# EAGLE design FanControl (EAGLE 7.6.0)
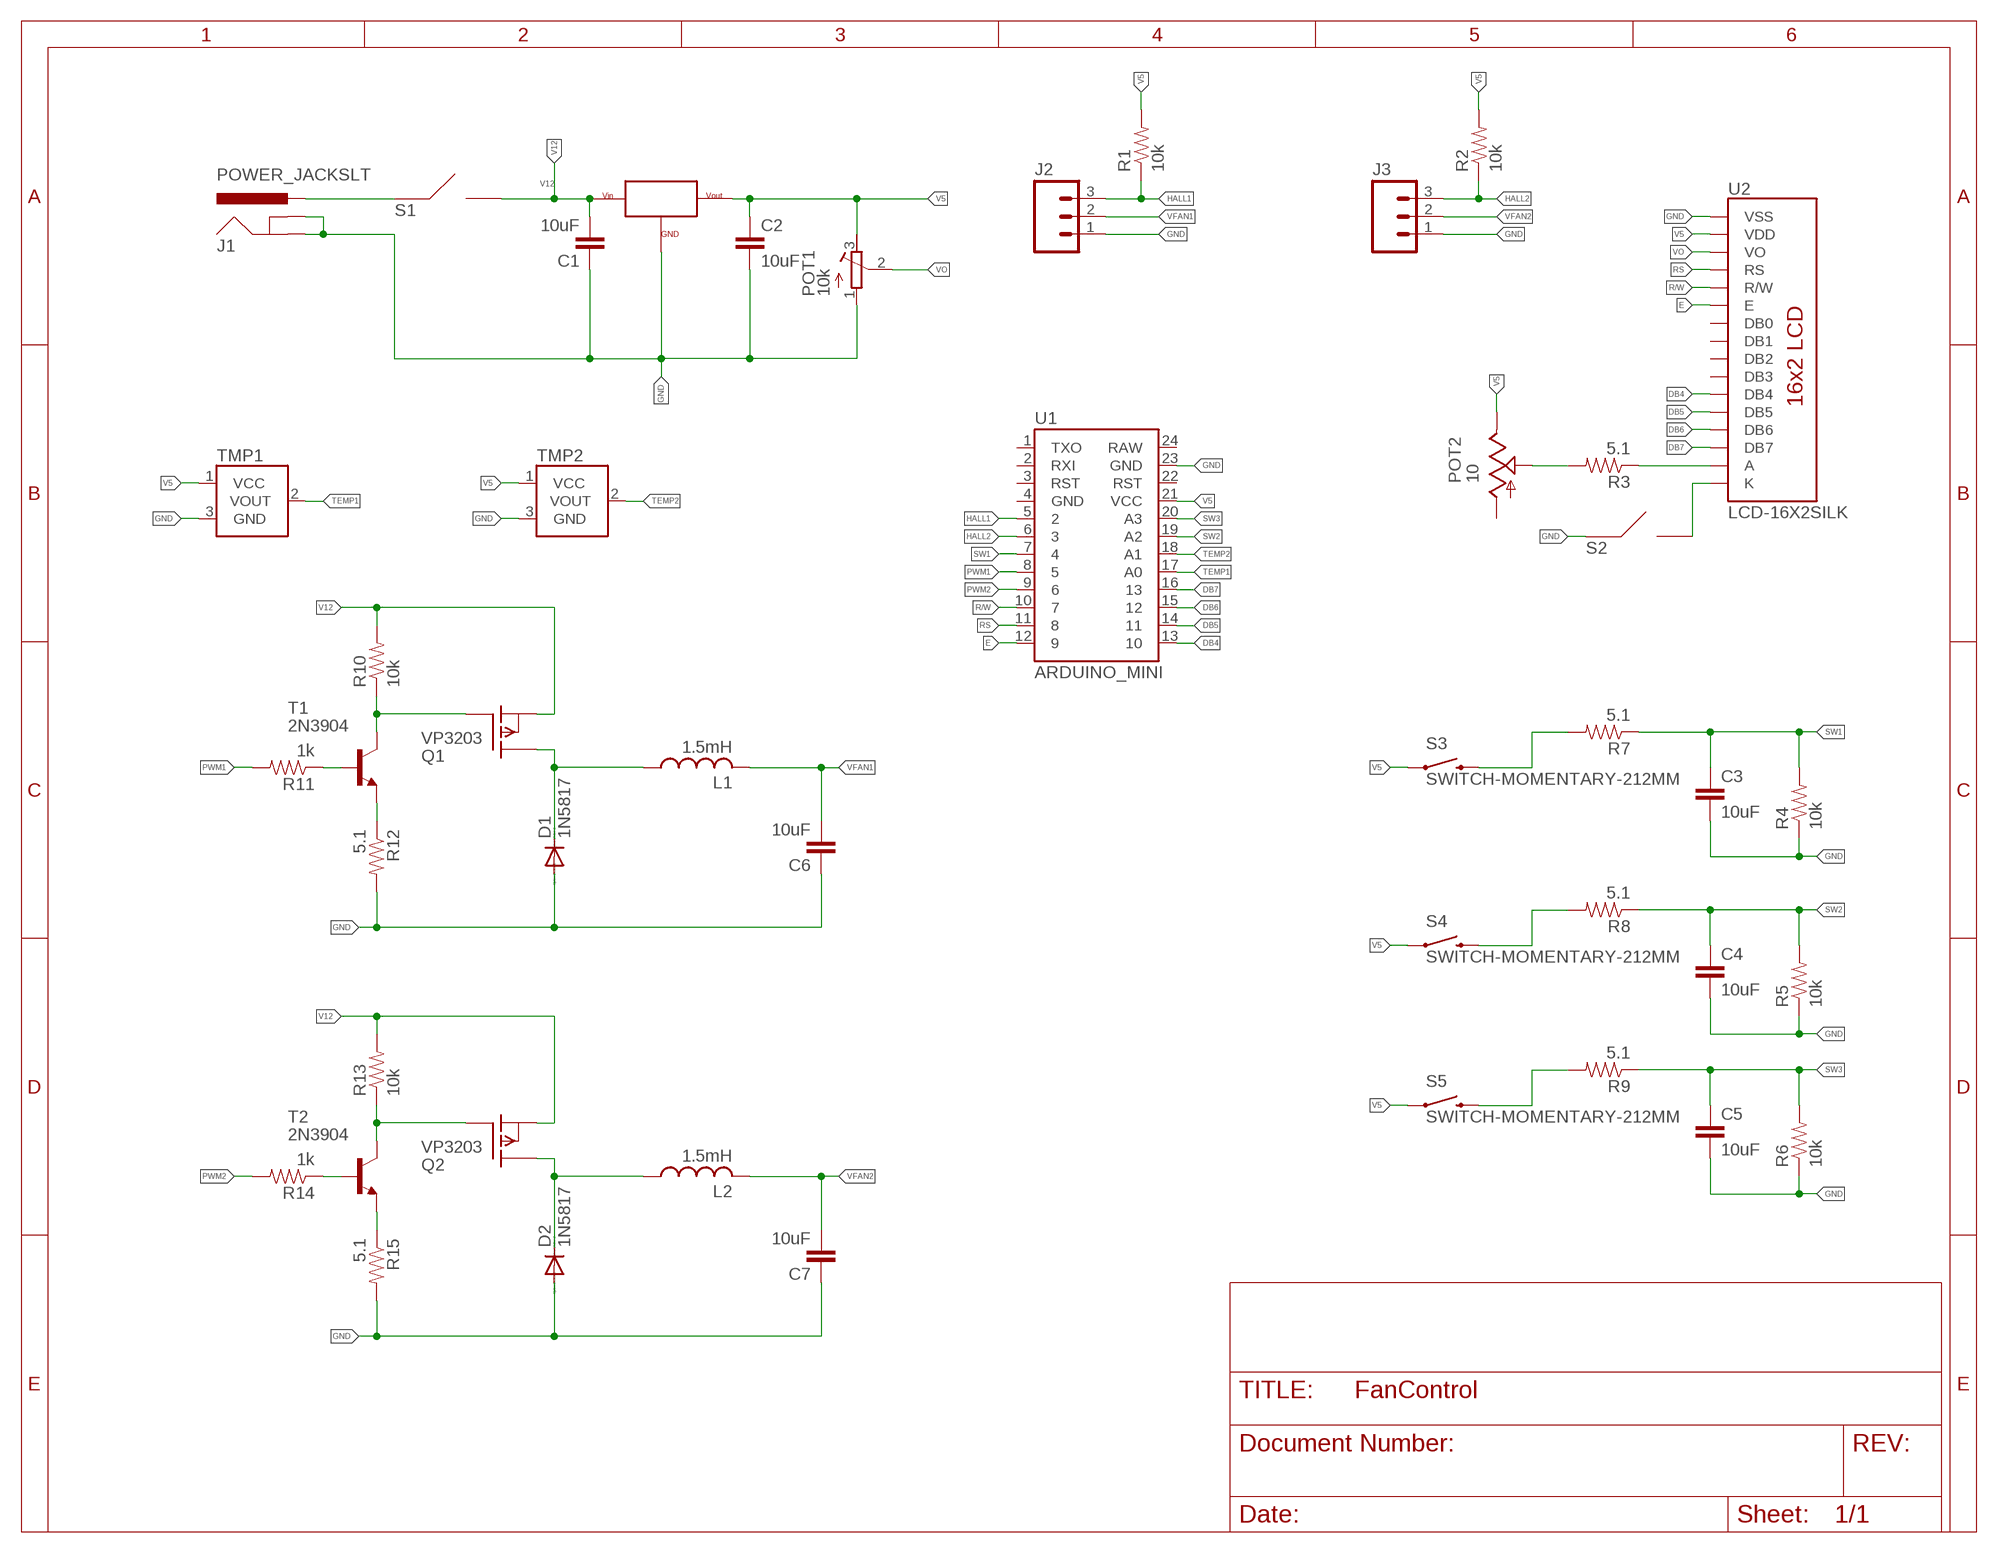
[diagram p0: schematic, sheet 1]

## Parts
C1  10uF  CAPPTH1  [CAP-PTH-5MM]
C2  10uF  CAPPTH1  [CAP-PTH-5MM]
C3  10uF  CAPPTH1  [CAP-PTH-5MM]
C4  10uF  CAPPTH1  [CAP-PTH-5MM]
C5  10uF  CAPPTH1  [CAP-PTH-5MM]
C6  10uF  CAPPTH1  [CAP-PTH-5MM]
C7  10uF  CAPPTH1  [CAP-PTH-5MM]
D1  1N5817  UF4003  [DO41-10]
D2  1N5817  UF4003  [DO41-10]
J1  POWER_JACKSLT  [POWER_JACK_SLOT]
J2  M03POLAR  [MOLEX-1X3]
J3  M03POLAR  [MOLEX-1X3]
L1  1.5mH  L-US0204/7  [0204/7]
L2  1.5mH  L-US0204/7  [0204/7]
POT1  10k  RTRIM-3362P  [RTRIM3362P]
POT2  10  TRIM_US-B25P  [B25P]
Q1  VP3203  TP0602N3  [TO-92]
Q2  VP3203  TP0602N3  [TO-92]
R1  10k  RESISTORPTH-1/6W  [1/6W-RES]
R2  10k  RESISTORPTH-1/6W  [1/6W-RES]
R3  5.1  RESISTORPTH-1/6W  [1/6W-RES]
R4  10k  RESISTORPTH-1/6W  [1/6W-RES]
R5  10k  RESISTORPTH-1/6W  [1/6W-RES]
R6  10k  RESISTORPTH-1/6W  [1/6W-RES]
R7  5.1  RESISTORPTH-1/6W  [1/6W-RES]
R8  5.1  RESISTORPTH-1/6W  [1/6W-RES]
R9  5.1  RESISTORPTH-1/6W  [1/6W-RES]
R10  10k  RESISTORPTH-1/6W  [1/6W-RES]
R11  1k  RESISTORPTH-1/6W  [1/6W-RES]
R12  5.1  RESISTORPTH-1/6W  [1/6W-RES]
R13  10k  RESISTORPTH-1/6W  [1/6W-RES]
R14  1k  RESISTORPTH-1/6W  [1/6W-RES]
R15  5.1  RESISTORPTH-1/6W  [1/6W-RES]
S1  SLIDE_SWITCH  [TH_SLIDE_SWITCH]
S2  SLIDE_SWITCH  [TH_SLIDE_SWITCH]
S3  SWITCH-MOMENTARY-212MM  [TACTILE-PTH-12MM]
S4  SWITCH-MOMENTARY-212MM  [TACTILE-PTH-12MM]
S5  SWITCH-MOMENTARY-212MM  [TACTILE-PTH-12MM]
T1  2N3904  [TO92]
T2  2N3904  [TO92]
TMP1  TMP36GT9  [TO-92]
TMP2  TMP36GT9  [TO-92]
U1  ARDUINO_MINI  [ARDUINO_MINI]
U2  LCD-16X2SILK  [LCD-16X2]
U$1  R-78EXX-0.5  [R-78EXX-0.5]

## Nets
DB4: U1.13 U2.11(DB4)
DB5: U1.14 U2.12(DB5)
DB6: U1.15 U2.13(DB6)
DB7: U1.16 U2.14(DB7)
E: U1.12 U2.6(E)
GND: C1.1 C2.2 C3.2 C4.2 C5.2 C6.1 C7.1 D1.A D2.A J1.GND@1(GNDBREAK) J1.GND@2(GND) J2.1 J3.1 POT1.1 R4.1 R5.1 R6.1 R12.2 R15.2 S2.A TMP1.3(GND) TMP2.3(GND) U1.23(GND) U2.1(VSS) U$1.GND
HALL1: J2.3 R1.1 U1.5
HALL2: J3.3 R2.1 U1.6
N$1: POT2.S R3.2
N$2: R3.1 U2.15(A)
N$3: J1.PWR S1.A
N$4: S2.B U2.16(K)
N$5: R7.2 S3.3
N$6: R8.2 S4.3
N$7: R9.2 S5.3
N$8: R12.1 T1.3(E)
N$9: Q1.2(G) R10.1 T1.1(C)
N$10: R11.1 T1.2(B)
N$11: D1.C L1.1 Q1.3(D)
N$12: Q2.2(G) R13.1 T2.1(C)
N$13: R14.1 T2.2(B)
N$14: R15.1 T2.3(E)
N$15: D2.C L2.1 Q2.3(D)
PWM1: R11.2 U1.8
PWM2: R14.2 U1.9
R/W: U1.10 U2.5(R/W)
RS: U1.11 U2.4(RS)
SW1: C3.1 R4.2 R7.1 U1.7
SW2: C4.1 R5.2 R8.1 U1.19(A2)
SW3: C5.1 R6.2 R9.1 U1.20(A3)
TEMP1: TMP1.2(VOUT) U1.17(A0)
TEMP2: TMP2.2(VOUT) U1.18(A1)
V5: C2.1 POT1.3 POT2.E R1.2 R2.2 S3.1 S4.1 S5.1 TMP1.1(VCC) TMP2.1(VCC) U1.21(VCC) U2.2(VDD) U$1.VOUT
V12: C1.2 Q1.1(S) Q2.1(S) R10.2 R13.2 S1.B U$1.VIN
VFAN1: C6.2 J2.2 L1.2
VFAN2: C7.2 J3.2 L2.2
VO: POT1.2 U2.3(VO)
Unconnected: POT2.A U1.1(TXO) U1.2(RXI) U1.3(RST) U1.4(GND) U1.22(RST) U1.24(RAW) U2.7(DB0) U2.8(DB1) U2.9(DB2) U2.10(DB3)

## Library data of the parts
C1-C7 = SparkFun-Capacitors:CAP: Capacitor Standard 0603 ceramic capacitor, and 0.1" leaded capacitor.
D1 D2 = diode:UF4003: DIODE ultrafast recovery diode, 200 V rectifier
J1 = SparkFun-Connectors:POWER_JACK: Power Jack This is the standard 5.5mm barrel jack for power. The PTH is the most common, proven, reliable, footprint. The Slot footprint only works if the mill layer is transmitted to the PCB fab house so be warned. Mating wall wart : TOL-00298 (and others); PROD_ID: PRT-00119
J2 J3 = SparkFun-Connectors:M03: Header 3 Standard 3-pin 0.1" header. Use with straight break away headers (SKU : PRT-00116), right angle break away headers (PRT-00553), swiss pins (PRT-00743), machine pins (PRT-00117), and female headers (PRT-00115). Molex polarized connector foot print use with SKU : PRT-08232 with associated crimp pins and housings.
L1 L2 = rcl:L-US: INDUCTOR, American symbol
POT1 = GeekAmmo:RTRIM: BOURNS 3362 - 1/4" Square Trimpot® Trimming Potentiometer
POT2 = pot:TRIM_US-: POTENTIOMETER
Q1 Q2 = transistor-fet:TP0602N3: P-Channel Enhancement MOSFET -20V; -2A; 2,0Ohm
R1-R15 = SparkFun-Passives:RESISTOR: Resistor Basic schematic elements and footprints for 0603, 1206, and PTH resistors.
S1 S2 = rancuret:SLIDE_SWITCH
S3-S5 = SparkFun-Electromechanical:SWITCH-MOMENTARY-2: Various NO switches- pushbuttons, reed, etc; PROD_ID: SWCH-09185
T1 T2 = transistor:2N3904: NPN TRANSISTOR
TMP1 TMP2 = SparkFun-Sensors:TMP36: Precision degC temp sensor, analog out
U1 = SparkFun-Boards:ARDUINO_MINI: Arduino Pro Mini footprint
U2 = SparkFun-Displays:LCD-16X2: Standard text-only 16x2 parallel input LCD
U$1 = rancuret:R-78EXX-0.5

## Net classes
0 default: width 0.305 mm, drill 0.508 mm, clearance 0.254 mm

## Board
This board is capable of powering and controlling two 3-wire PC cooling fans. Two on-board temperature measurements and two fan speed feedbacks are provided to the Arduino microcontroller. Momentary buttons with debouncing provided for user input, while an LCD screen is provided for displaying information to the user. Arduino PWM outputs operate separate buck converters to regulate each fan voltage independently.
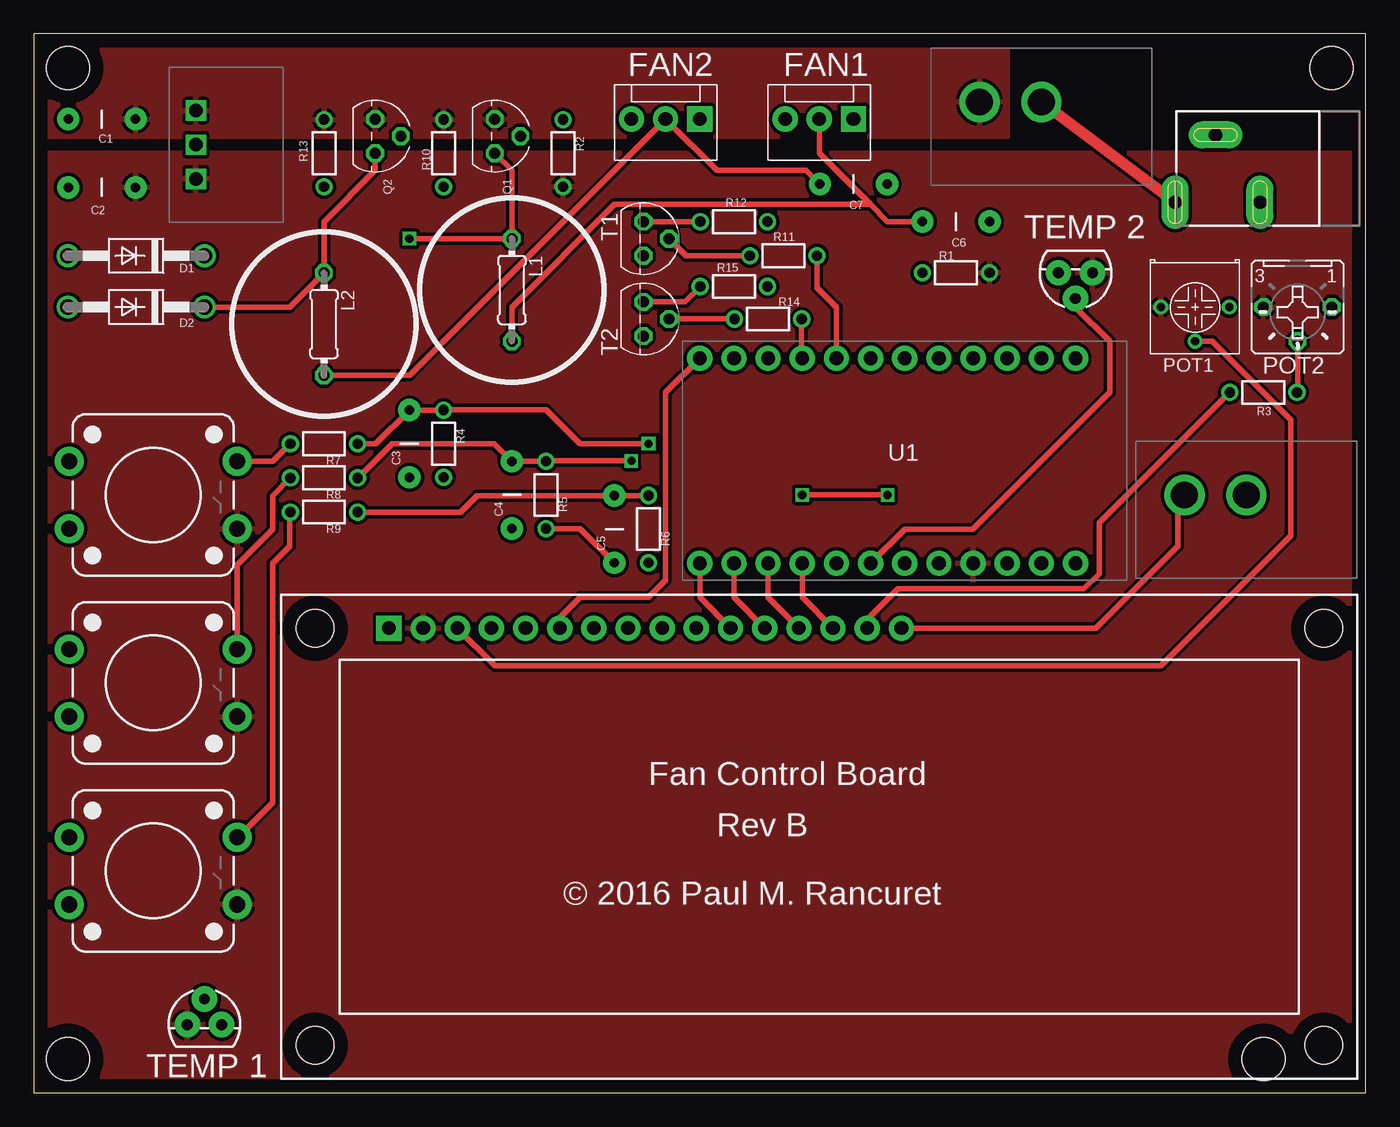
[diagram p1: board, top side]
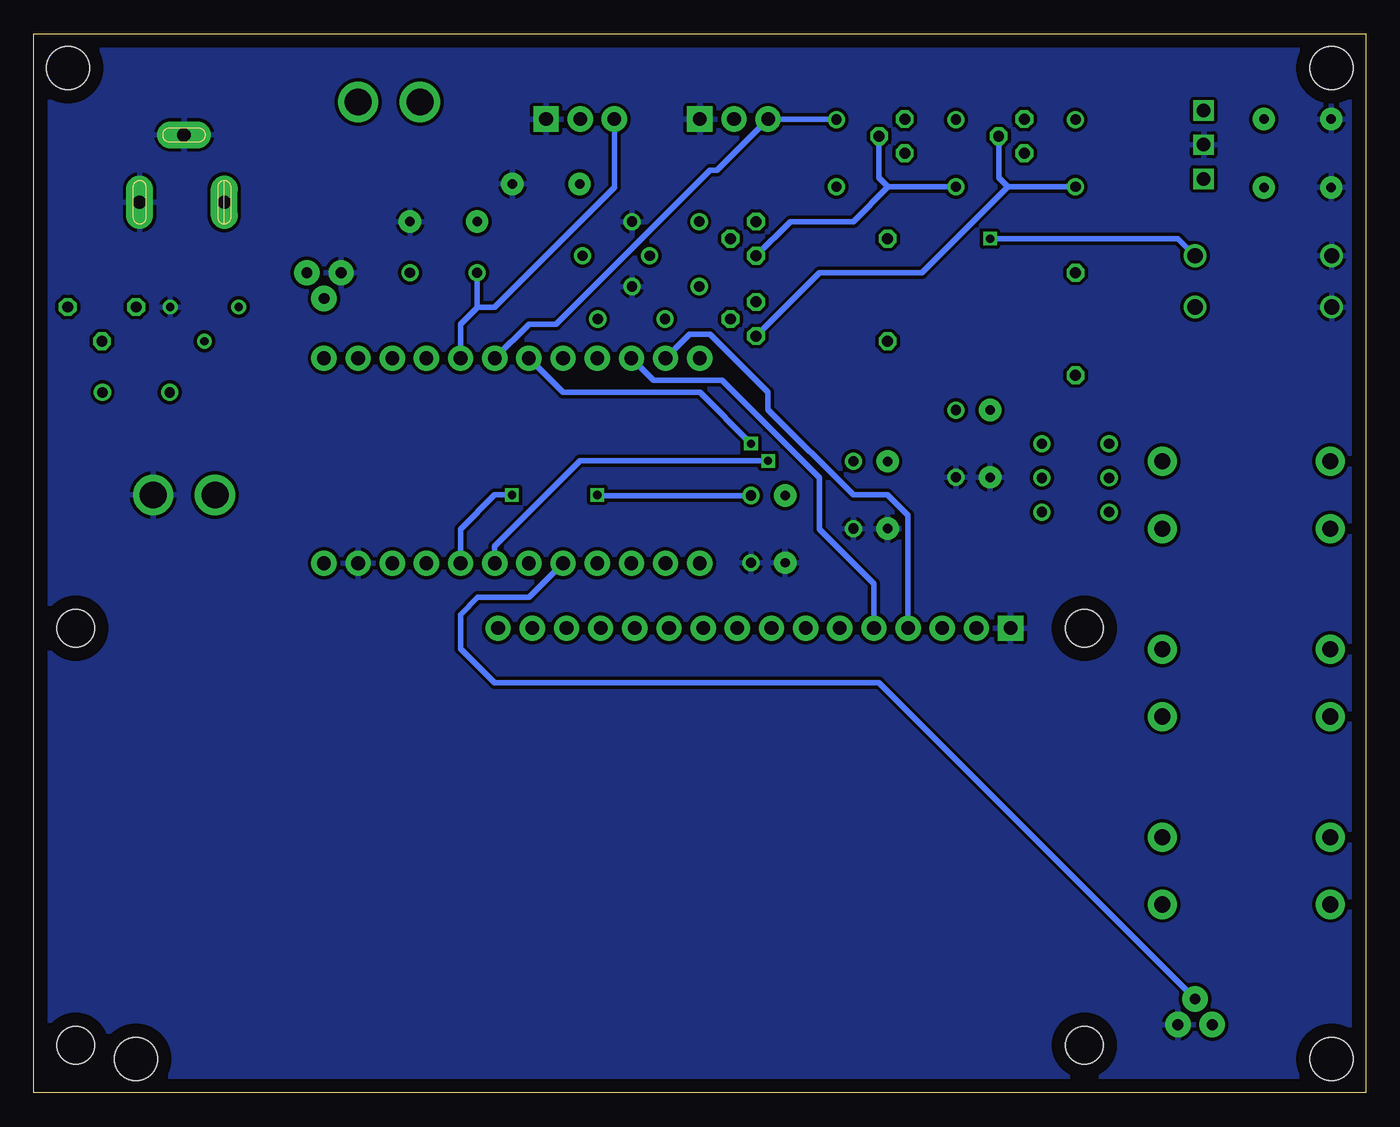
[diagram p2: board, bottom side, seen from below]

Size 99.06 x 78.74 mm. Coordinates in mm from the lower left corner, seen from the top.
Outline: 0,0 99.06,0 99.06,78.74 0,78.74 0,0
Copper layers (1*16): Top 0.01778125mm / dielectric 60mil / Bottom 0.01778125mm
Design rules "default *": minimum track width 10mil, minimum drill 20mil, track to track 8mil, track to pad 8mil, pad to pad 8mil, via to via 8mil, smd to smd 8mil, copper to edge 40mil, drill to drill 8mil, minimum pad ring 10mil, minimum via ring 8mil, stop-mask expansion 4mil, vias tented up to drill 0mil, thermal gap 10mil
Holes 3.2 mm at 2.54,76.2 96.52,76.2 91.44,2.54 2.54,2.54

### Footprints (pad centres in the part's own frame; a part is rotated, then mirrored left to right if it is on the bottom)
CAP-PTH-5MM = drill 0.7 pad 1.651: 1 -2.5,0; 2 2.5,0
DO41-10 = drill 1.118: A 5.08,0; C -5.08,0
POWER_JACK_SLOT = drill 1 pad 2 long: GND@1 2.58,7.5; GND@2 7.58,10.8; PWR 2.58,13.8
MOLEX-1X3 = drill 1.016 pad 1.88 square: 1 0,0 | drill 1.016 pad 1.88: 2 2.54,0; 3 5.08,0
0204/7 = drill 0.813 octagon: 1 -3.81,0; 2 3.81,0
RTRIM3362P = drill 0.6: 1 -2.54,-2.54; 2 0,0; 3 2.54,-2.54
B25P = drill 0.813 octagon: A -2.54,0; E 2.54,0; S 0,2.54
TO-92 = drill 0.813 octagon: 1 -1.27,0; 2 0,1.905; 3 1.27,0
1/6W-RES = drill 0.762: 1 -2.5,0; 2 2.5,0
TH_SLIDE_SWITCH = drill 2: A 0,0; B 0,4.597
TACTILE-PTH-12MM = drill 1.2 pad 2.159: 1 6.25,-2.5; 2 -6.25,-2.5; 3 6.25,2.5; 4 -6.25,2.5
TO92 = drill 0.813 octagon: 1 1.27,0; 2 0,1.905; 3 -1.27,0
TO-92' = drill 0.813 pad 1.88: 1 -1.27,0; 2 0,1.905; 3 1.27,0
ARDUINO_MINI = drill 1.016 pad 1.88: 1 -7.62,12.7; 2 -7.62,10.16; 3 -7.62,7.62; 4 -7.62,5.08; 5 -7.62,2.54; 6 -7.62,0; 7 -7.62,-2.54; 8 -7.62,-5.08; 9 -7.62,-7.62; 10 -7.62,-10.16; 11 -7.62,-12.7; 12 -7.62,-15.24; 13 7.62,-15.24; 14 7.62,-12.7; 15 7.62,-10.16; 16 7.62,-7.62; 17 7.62,-5.08; 18 7.62,-2.54; 19 7.62,0; 20 7.62,2.54; 21 7.62,5.08; 22 7.62,7.62; 23 7.62,10.16; 24 7.62,12.7
LCD-16X2 = drill 1.016 pad 1.88 square: 1 -32,15.5 | drill 1.016 pad 1.88: 2 -29.46,15.5; 3 -26.92,15.5; 4 -24.38,15.5; 5 -21.84,15.5; 6 -19.3,15.5; 7 -16.76,15.5; 8 -14.22,15.5; 9 -11.68,15.5; 10 -9.14,15.5; 11 -6.6,15.5; 12 -4.06,15.5; 13 -1.52,15.5; 14 1.02,15.5; 15 3.56,15.5; 16 6.1,15.5 | hole 2.8: -37.5,15.5; -37.5,-15.5; 37.5,15.5; 37.5,-15.5
R-78EXX-0.5 = drill 1 square: GND 0,0; VIN 0,2.54; VOUT 0,-2.54

### Placement (x,y rotation side)
C1  5.08,72.39 0 top
C2  5.08,67.31 180 top
C3  27.94,48.26 270 top
C4  35.56,44.45 270 top
C5  43.18,41.91 270 top
C6  68.58,64.77 180 top
C7  60.96,67.56 180 top
D1  7.62,62.23 180 top
D2  7.62,58.42 180 top
J1  98.68,63.63 90 top
J2  60.96,72.39 180 top
J3  49.53,72.39 180 top
L1  35.56,59.69 270 top
L2  21.59,57.15 270 top
POT1  86.36,55.88 180 top
POT2  93.98,58.42 180 top
Q1  34.29,71.12 270 top
Q2  25.4,71.12 270 top
R1  68.58,60.96 0 top
R2  39.37,69.85 270 top
R3  91.44,52.07 0 top
R4  30.48,48.26 90 top
R5  38.1,44.45 90 top
R6  45.72,41.91 90 top
R7  21.59,48.26 180 top
R8  21.59,45.72 180 top
R9  21.59,43.18 180 top
R10  30.48,69.85 90 top
R11  55.75,62.23 0 top
R12  52.07,64.77 0 top
R13  21.59,69.85 90 top
R14  54.61,57.53 0 top
R15  52.07,59.94 0 top
S1  74.93,73.66 90 top
S2  90.17,44.45 90 top
S3  8.89,44.45 0 top
S4  8.89,30.48 0 top
S5  8.89,16.51 0 top
T1  45.34,63.5 270 top
T2  45.34,57.53 270 top
TMP1  [TO-92']  12.7,5.08 0 top
TMP2  [TO-92']  77.47,60.96 180 top
U1  64.77,46.99 270 top
U2  58.42,19.05 0 top
U$1  12.06,70.48 0 top

### Tracks (layer width: path | path; a pad name or v marks a point on that pad's centre or on a via)
DB4
  Top 0.406: U1.13 49.53,36.84 U2.11
DB5
  Top 0.406: U1.14 52.07,36.84 U2.12
DB6
  Top 0.406: U1.15 54.61,36.84 U2.13
DB7
  Top 0.406: U1.16 57.15,36.84 U2.14
E
  Top 0.406: U2.6 39.12,35.31 40.64,36.83 45.72,36.83 46.99,38.1 46.99,52.07 U1.12
GND
  Top 0.406: R5.1 40.64,41.95 C5.2
  pour Bottom: -1.27,80.01 -1.27,-1.27 100.33,-1.27 100.33,80.01
HALL1
  Bottom 0.406: 66.04,58.42 67.31,57.15 U1.5 | R1.1 66.08,58.46 66.04,58.42 | 66.04,58.42 64.77,58.42 55.88,67.31 J2.3
HALL2
  Bottom 0.406: U1.6 62.23,57.15 60.2,57.15 48.77,68.58 48.26,68.58 J3.3 39.41,72.39 R2.1
N$1
  Top 0.406: POT2.S 93.98,52.11 R3.2
N$2
  Top 0.406: U2.15 61.98,35.18 64.26,37.47 78.11,37.47 79.25,38.61 79.25,42.38 R3.1
N$3
  Top 0.813: S1.A J1.PWR
N$4
  Top 0.406: U2.16 79,34.55 85.09,40.64 85.09,43.97 S2.B
N$5
  Top 0.406: S3.3 17.78,46.95 R7.2
N$6
  Top 0.406: S4.3 15.14,39.27 17.78,41.91 17.78,44.41 R8.2
N$7
  Top 0.406: S5.3 15.2,19.01 17.78,21.59 17.78,39.37 19.05,40.64 19.05,43.14 R9.2
N$8
  Top 0.406: T1.3 R12.1
N$9
  Bottom 0.406: R10.1 35.52,67.35 | 35.52,67.35 38.1,64.77 42.8,64.77 T1.1 | Q1.2 36.2,68.03 35.52,67.35
N$10
  Top 0.406: R11.1 48.51,62.23 T1.2
N$11  (via drill 0.6)
  Top 0.406: v27.94,63.5 L1.1 35.56,68.58 Q1.3
  Bottom 0.406: v27.94,63.5 13.97,63.5 D1.C
N$12
  Bottom 0.406: R13.1 26.63,67.35 | 26.63,67.35 33.02,60.96 40.64,60.96 T2.1 | Q2.2 27.3,68.03 26.63,67.35
N$13
  Top 0.406: R14.1 T2.2
N$14
  Top 0.406: T2.3 48.43,58.8 R15.1
N$15
  Top 0.406: D2.C 19.05,58.42 L2.1 21.59,64.77 25.4,68.58 Q2.3
PWM1
  Top 0.406: R11.2 58.25,59.86 59.69,58.42 U1.8
PWM2
  Top 0.406: R14.2 57.11,54.65 U1.9
R/W
  Bottom 0.406: U2.5 36.58,37.85 40.64,41.91 40.64,45.72 47.88,52.96 52.96,52.96 U1.10
RS
  Bottom 0.406: U2.4 34.04,42.93 35.56,44.45 38.1,44.45 44.45,50.8 44.45,52.07 48.77,56.39 50.29,56.39 U1.11
SW1  (via drill 0.6)
  Top 0.406: R7.1 25.44,48.26 C3.1 R4.2 30.52,50.8 38.1,50.8 40.64,48.26 v45.72,48.26
  Bottom 0.406: U1.7 59.69,52.07 49.53,52.07 v45.72,48.26
SW2  (via drill 0.6)
  Top 0.406: v44.45,46.99 38.14,46.99 R5.2 C4.1 34.25,48.26 26.67,48.26 24.13,45.72 R8.1
  Bottom 0.406: U1.19 64.77,40.64 58.42,46.99 v44.45,46.99
SW3  (via drill 0.6)
  Top 0.406: R6.2 C5.1 32.98,44.41 31.75,43.18 R9.1 | v57.15,44.45 v63.5,44.45
  Bottom 0.406: R6.2 57.11,44.41 v57.15,44.45 | v63.5,44.45 64.77,44.45 67.31,41.91 U1.20
TEMP1
  Bottom 0.406: U1.17 62.23,36.83 66.04,36.83 67.31,35.56 67.31,33.02 64.77,30.48 36.2,30.48 TMP1.2
TEMP2
  Top 0.406: TMP2.2 77.47,58.42 80.01,55.88 80.01,52.07 69.85,41.91 64.77,41.91 U1.18
V5
  pour Top: -1.27,69.85 100.33,69.85 100.33,-1.27 -1.27,-1.27
V12
  pour Top: 72.39,80.01 72.39,71.12 -1.27,71.12 -1.27,80.01
VFAN1
  Top 0.406: J2.2 58.42,69.85 62.23,66.04 | 62.23,66.04 63.5,64.77 C6.2 | L1.2 35.56,58.42 43.18,66.04 62.23,66.04
VFAN2
  Top 0.406: L2.2 27.94,53.34 J3.2 50.8,68.58 57.44,68.58 C7.2
VO
  Top 0.406: POT1.2 87.63,55.88 93.47,50.04 93.47,41.4 83.82,31.75 34.3,31.75 U2.3

### Text on the board
tPlace: FAN2 | FAN1 | TEMP 2 | Fan Control Board | Rev B | © 2016 Paul M. Rancuret | TEMP 1